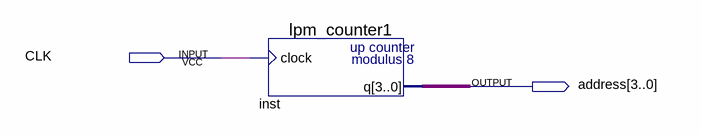
[diagram p0: schematic sheet]
// Quartus schematic PC.bdf as structural Verilog: 1 symbols, 2 pins
module PC (
  input  CLK,
  output [3:0] address
);

  lpm_counter1 inst (.clock(CLK), .q(address));
endmodule
